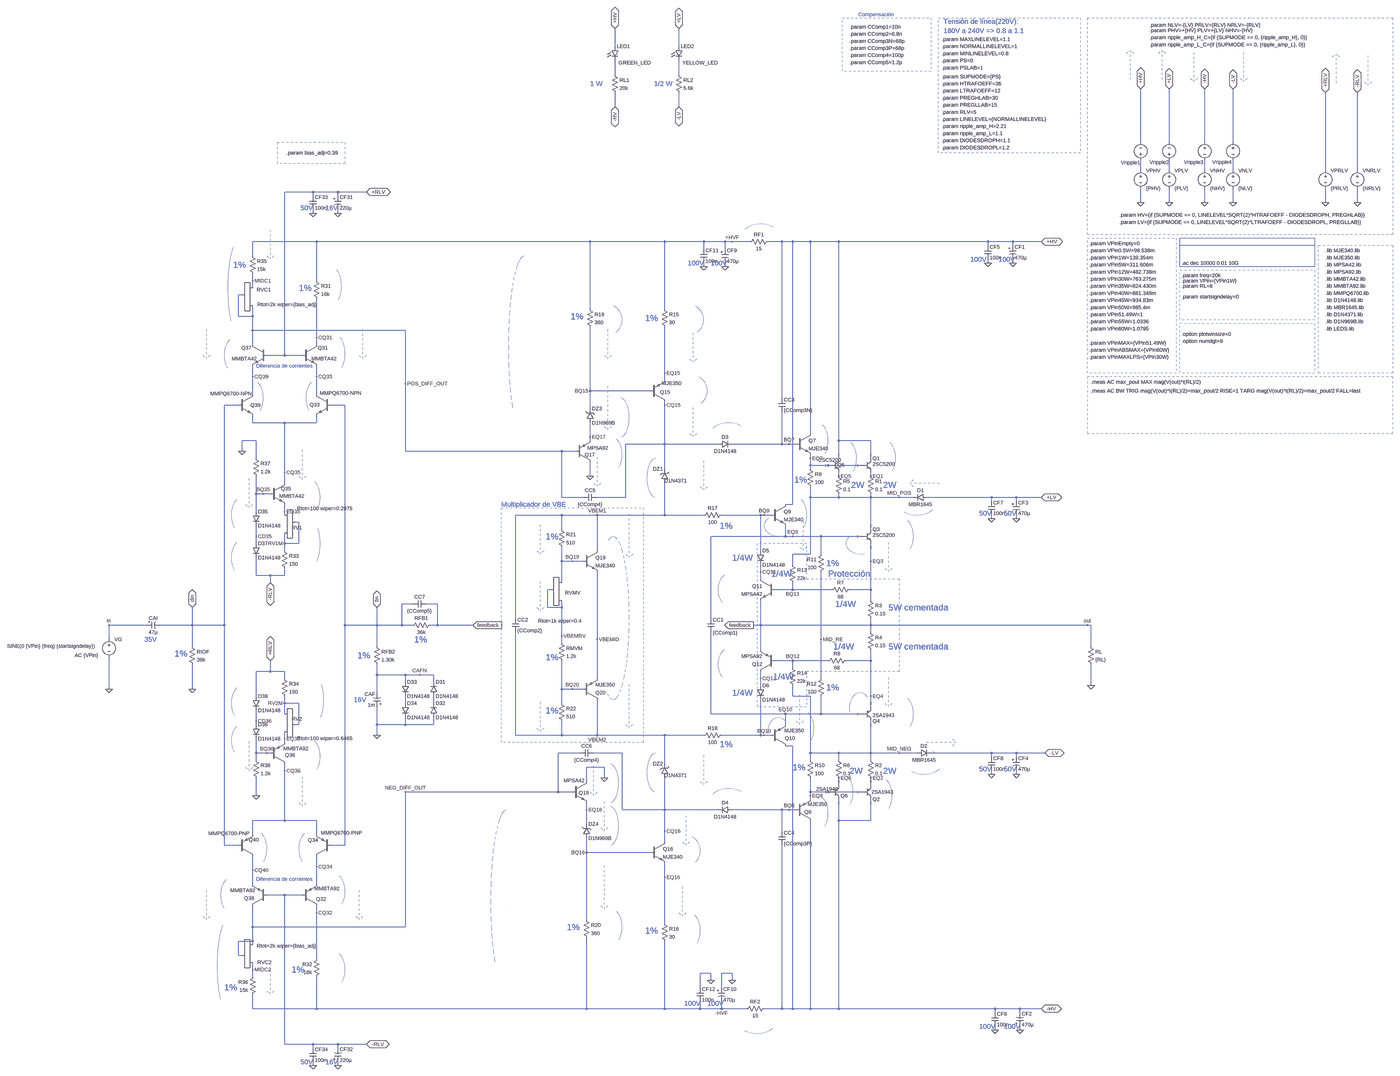
[diagram p0: schematic amplifier_V2.1_1W_BW.asc, whole sheet]
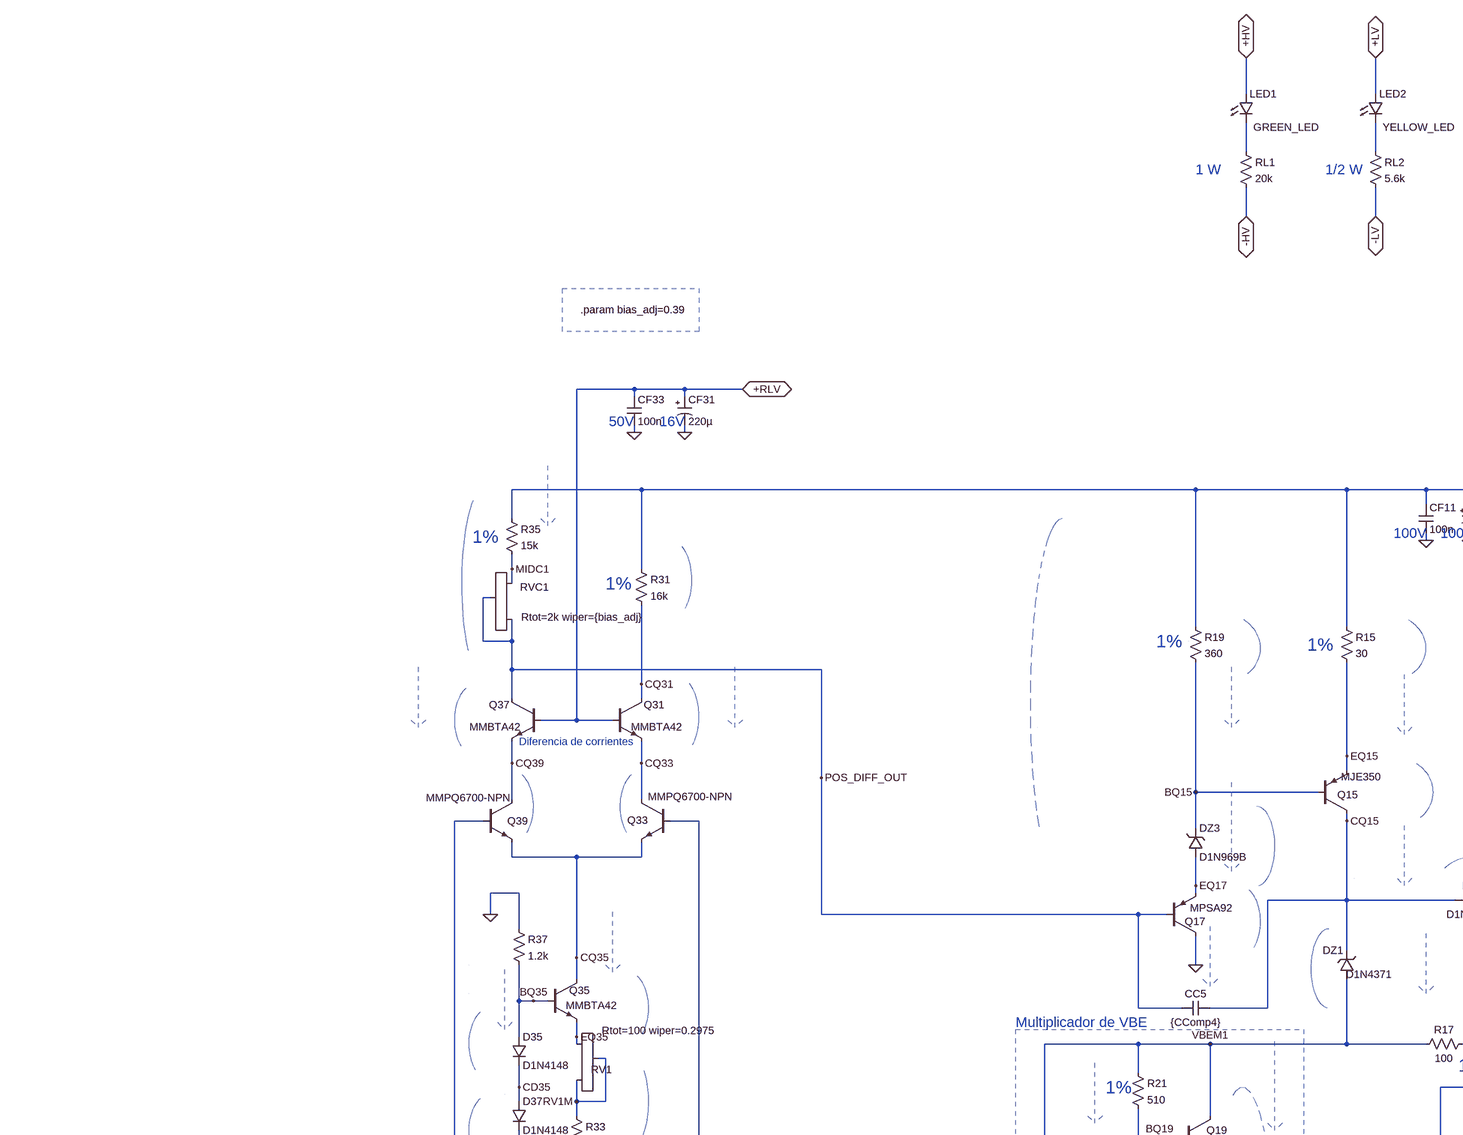
[diagram p1: schematic amplifier_V2.1_1W_BW.asc, part, row 1 of 2, column 1 of 2]
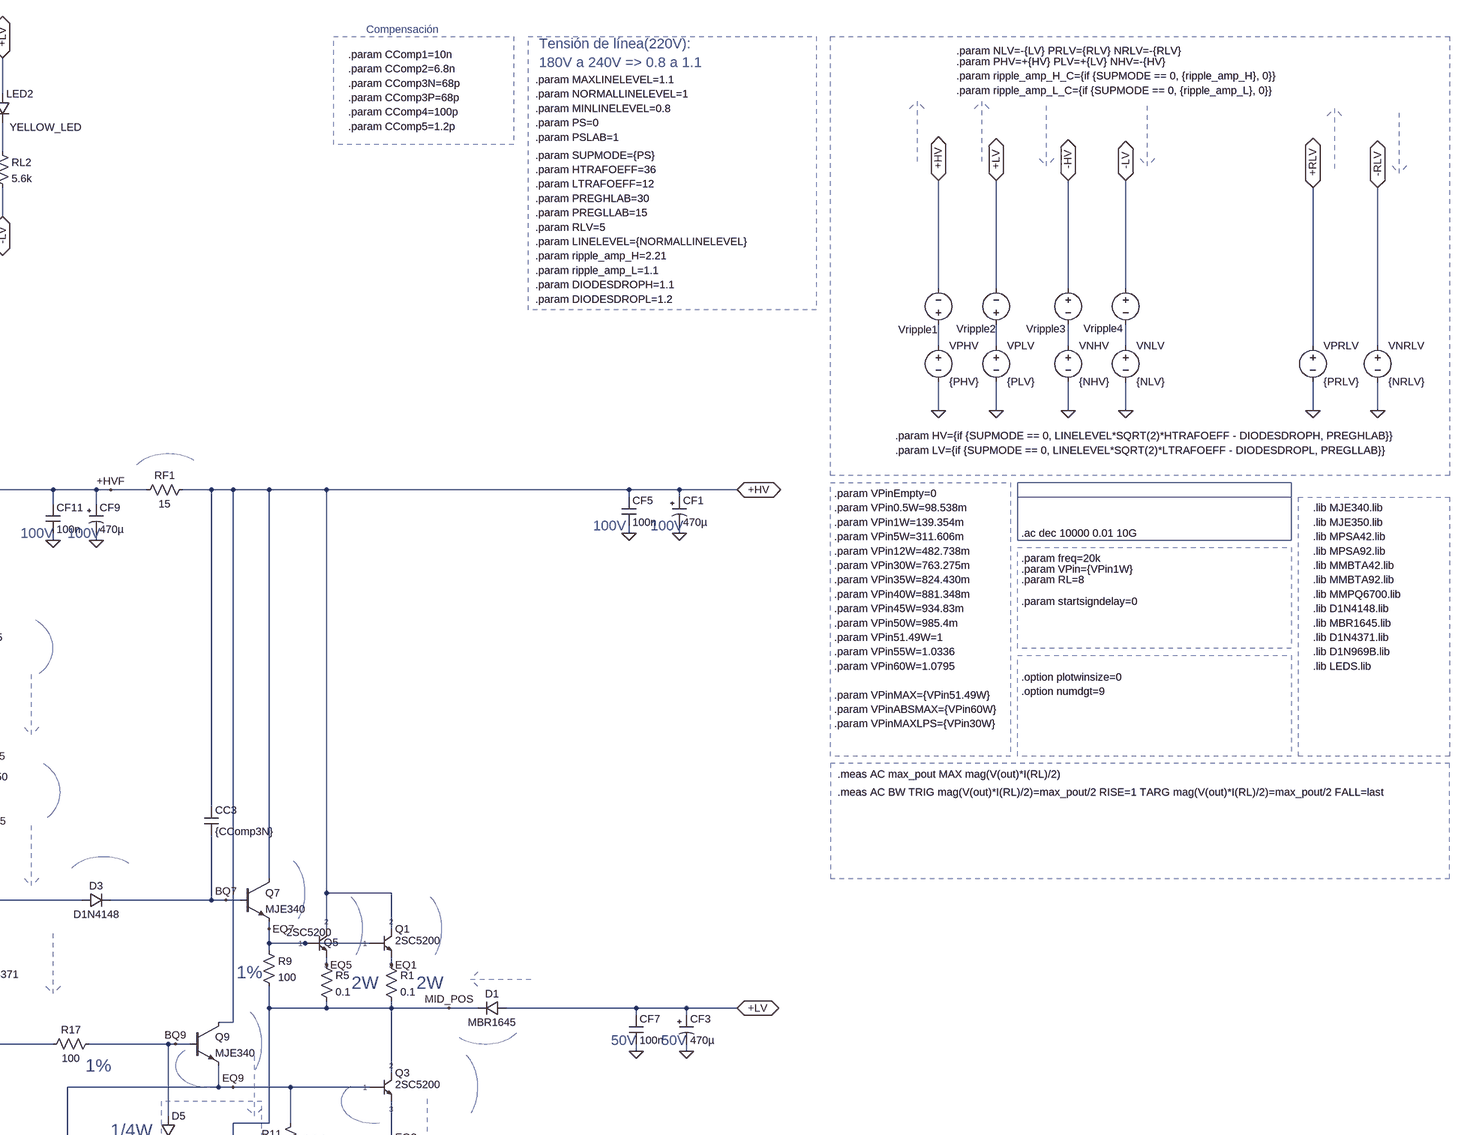
[diagram p2: schematic amplifier_V2.1_1W_BW.asc, part, row 1 of 2, column 2 of 2]
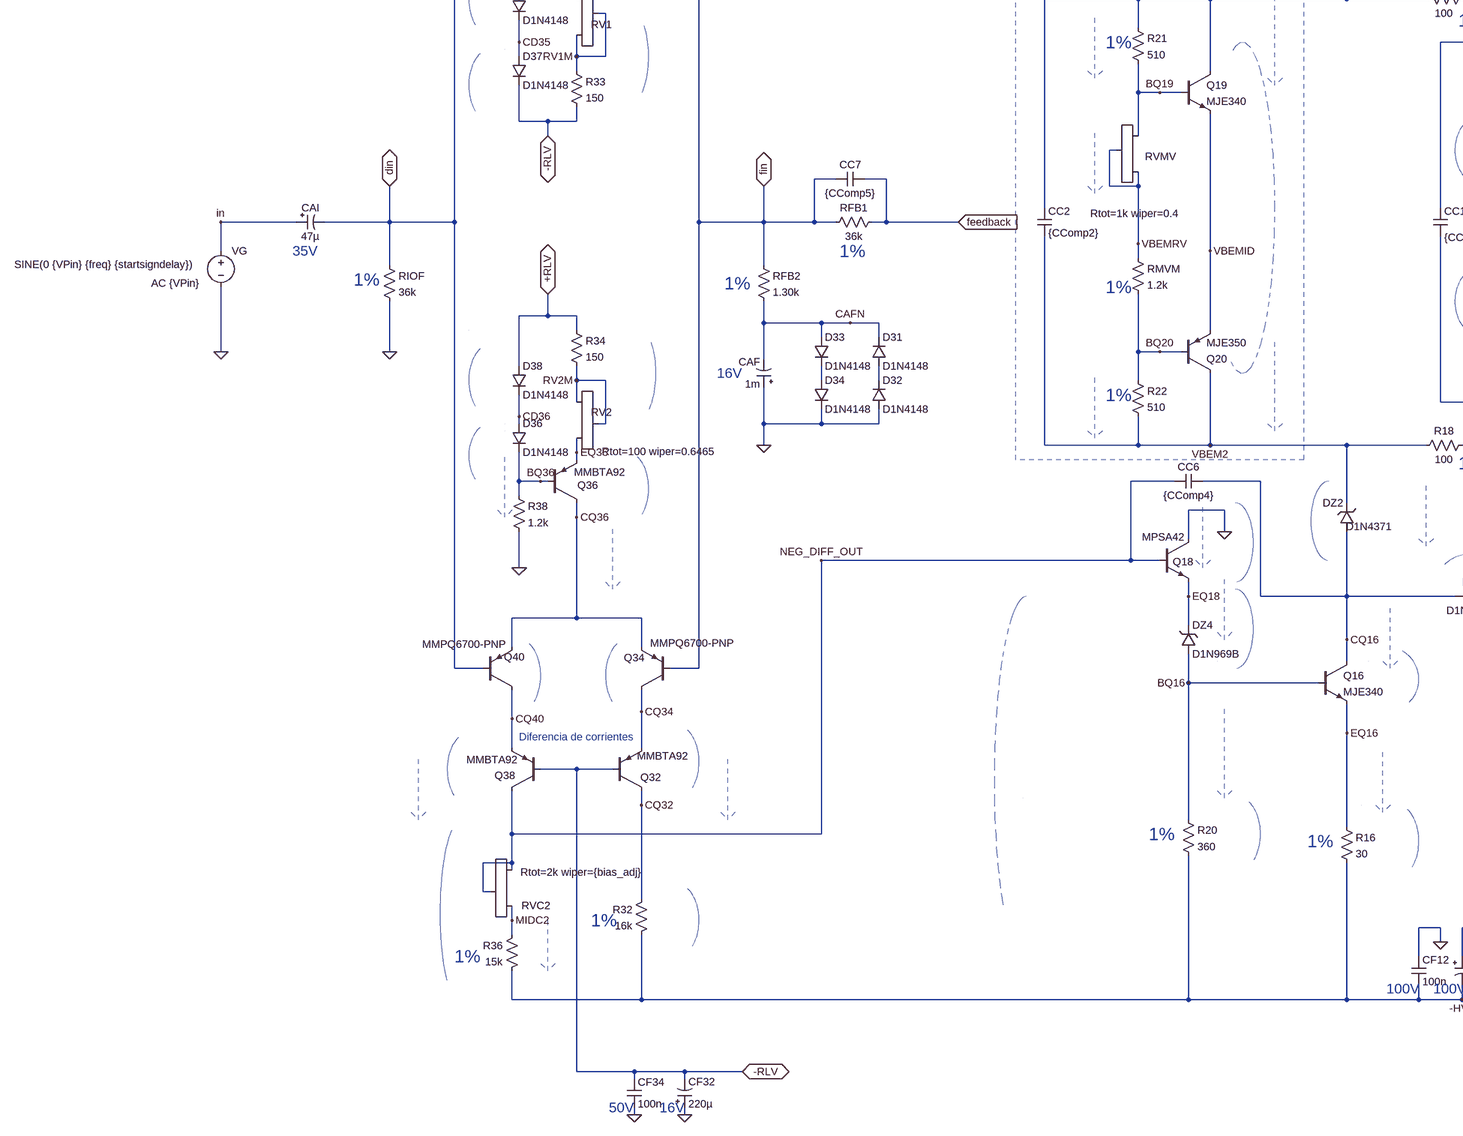
[diagram p3: schematic amplifier_V2.1_1W_BW.asc, part, row 2 of 2, column 1 of 2]
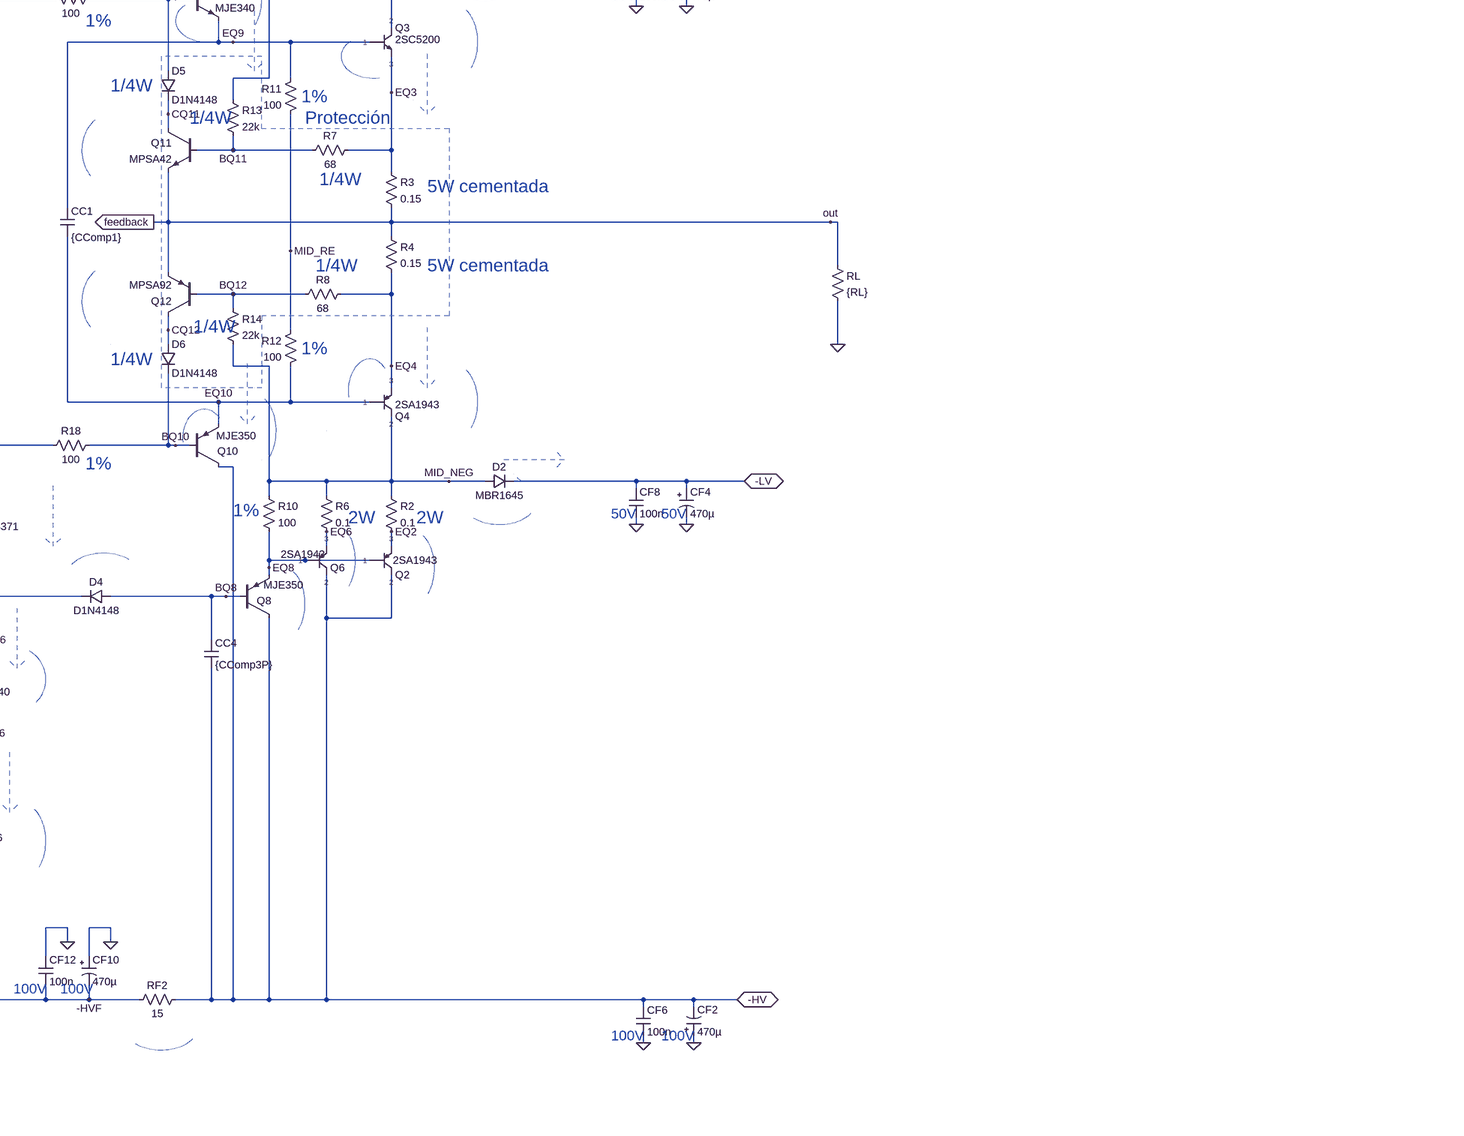
[diagram p4: schematic amplifier_V2.1_1W_BW.asc, part, row 2 of 2, column 2 of 2]
* amplifier_V2.1_1W_BW.asc
Q7 +HV BQ7 EQ7 0 MJE340
R9 EQ7 MID_POS 100
D3 CQ15 BQ7 D1N4148
Q9 +HV BQ9 EQ9 0 MJE340
R3 EQ3 feedback 0.15
R11 EQ9 MID_RE 100
R4 feedback EQ4 0.15
Q10 -HV BQ10 EQ10 0 MJE350
Q8 -HV BQ8 EQ8 0 MJE350
D4 BQ8 CQ16 D1N4148
D2 MID_NEG -LV MBR1645
R12 MID_RE EQ10 100
R2 MID_NEG EQ2 0.1
R6 MID_NEG EQ6 0.1
R5 EQ5 MID_POS 0.1
R1 EQ1 MID_POS 0.1
D1 +LV MID_POS MBR1645
Q20 VBEM2 BQ20 VBEMID 0 MJE350
Q19 VBEM1 BQ19 VBEMID 0 MJE340
R21 VBEM1 BQ19 510
R22 BQ20 VBEM2 510
R17 VBEM1 BQ9 100
R18 BQ10 VBEM2 100
Q15 CQ15 BQ15 EQ15 0 MJE350
Q16 CQ16 BQ16 EQ16 0 MJE340
Q18 0 NEG_DIFF_OUT EQ18 0 MPSA42
RFB2 fin CAFN 1.30k
RFB1 feedback fin 36k
RIOF din 0 36k
Q17 0 POS_DIFF_OUT EQ17 0 MPSA92
Q39 CQ39 din CQ35 0 MMPQ6700-NPN
Q33 CQ33 fin CQ35 0 MMPQ6700-NPN
Q40 CQ40 din CQ36 0 MMPQ6700-PNP
Q34 CQ34 fin CQ36 0 MMPQ6700-PNP
CC5 CQ15 POS_DIFF_OUT {CComp4}
CC6 CQ16 NEG_DIFF_OUT {CComp4}
R15 +HVF EQ15 30
R16 EQ16 -HVF 30
XQ5 +HV EQ7 EQ5 2SC5200  ; pins 2 1 3
XQ1 +HV EQ7 EQ1 2SC5200  ; pins 2 1 3
XQ3 MID_POS EQ9 EQ3 2SC5200  ; pins 2 1 3
XQ4 MID_NEG EQ10 EQ4 2SA1943  ; pins 2 1 3
XQ6 -HV EQ8 EQ6 2SA1943  ; pins 2 1 3
XQ2 -HV EQ8 EQ2 2SA1943  ; pins 2 1 3
R37 0 BQ35 1.2k
Q35 CQ35 BQ35 EQ35 0 MMBTA42
Q36 CQ36 BQ36 EQ36 0 MMBTA92
R38 BQ36 0 1.2k
RL feedback 0 {RL}
CC4 BQ8 -HV {CComp3P}
CC3 +HV BQ7 {CComp3N}
VG in 0 SINE(0 {VPin} {freq} {startsigndelay}) AC {VPin}
CF5 +HV 0 100n
CC7 feedback fin {CComp5}
XRVMV VBEMRV BQ19 VBEMRV Rtot=1k wiper=0.4
D38 +RLV CD36 D1N4148
D35 BQ35 CD35 D1N4148
Q12 CQ12 BQ12 feedback 0 MPSA92
Q11 CQ11 BQ11 feedback 0 MPSA42
D5 BQ9 CQ11 D1N4148
R7 EQ3 BQ11 68
R8 EQ4 BQ12 68
D6 CQ12 BQ10 D1N4148
R13 MID_POS BQ11 22k
R14 BQ12 MID_NEG 22k
CF1 +HV 0 470µ
CF7 +LV 0 100n
CF3 +LV 0 470µ
CF8 -LV 0 100n
CF4 -LV 0 470µ
CF6 -HV 0 100n
CF2 0 -HV 470µ
CF33 +RLV 0 100n
CF31 +RLV 0 220µ
CF34 -RLV 0 100n
CF32 0 -RLV 220µ
CAF 0 CAFN 1m
D33 CAFN N007 D1N4148
D34 N007 0 D1N4148
D32 0 N008 D1N4148
D31 N008 CAFN D1N4148
CAI in din 47µ
R10 MID_NEG EQ8 100
CC2 VBEM1 VBEM2 {CComp2}
VPHV N003 0 {PHV}
VPLV N004 0 {PLV}
VNHV N005 0 {NHV}
VNLV N006 0 {NLV}
VPRLV +RLV 0 {PRLV}
VNRLV -RLV 0 {NRLV}
DZ1 VBEM1 CQ15 D1N4371
DZ2 CQ16 VBEM2 D1N4371
CC1 EQ9 EQ10 {CComp1}
Q37 POS_DIFF_OUT +RLV CQ39 0 MMBTA42
R35 +HVF MIDC1 15k
Q38 NEG_DIFF_OUT -RLV CQ40 0 MMBTA92
R36 MIDC2 -HVF 15k
R19 +HVF BQ15 360
R20 BQ16 -HVF 360
Vripple4 -LV N006 PULSE({ripple_amp_L_C} 0 0 1m 9m 0 10m)
Vripple3 -HV N005 PULSE({ripple_amp_H_C} 0 0 1m 9m 0 10m)
Vripple1 N003 +HV PULSE({ripple_amp_H_C} 0 0 1m 9m 0 10m)
Vripple2 N004 +LV PULSE({ripple_amp_L_C} 0 0 1m 9m 0 10m)
D37 CD35 -RLV D1N4148
D36 CD36 BQ36 D1N4148
Q31 CQ31 +RLV CQ33 0 MMBTA42
R31 +HVF CQ31 16k
Q32 CQ32 -RLV CQ34 0 MMBTA92
R32 CQ32 -HVF 16k
D§LED2 +LV N002 YELLOW_LED
RL2 N002 -LV 5.6k
D§LED1 +HV N001 GREEN_LED
RL1 N001 -HV 20k
RF2 -HV -HVF 15
CF10 0 -HVF 470µ
RF1 +HV +HVF 15
CF9 +HVF 0 470µ
XRV1 RV1M EQ35 RV1M Rtot=100 wiper=0.2975 Rtap=0 tap=0.5
R33 RV1M -RLV 150
XRV2 RV2M EQ36 RV2M Rtot=100 wiper=0.6465 Rtap=0 tap=0.5
R34 +RLV RV2M 150
RMVM VBEMRV BQ20 1.2k
CF11 +HVF 0 100n
CF12 -HVF 0 100n
XRVC1 POS_DIFF_OUT MIDC1 POS_DIFF_OUT Rtot=2k wiper={bias_adj} Rtap=0 tap=0.5
XRVC2 NEG_DIFF_OUT MIDC2 NEG_DIFF_OUT Rtot=2k wiper={bias_adj} Rtap=0 tap=0.5
DZ3 EQ17 BQ15 D1N969B
DZ4 BQ16 EQ18 D1N969B
.model D D
.lib standard.dio
.model NPN NPN
.model PNP PNP
.lib standard.bjt
* Multiplicador de VBE
* Protección
* Diferencia de corrientes
* Diferencia de corrientes
.lib MBR1645.lib
.lib MJE340.lib
.lib MJE350.lib
.lib D1N4148.lib
.ac dec 10000 0.01 10G
.lib MMBTA42.lib
.lib MMBTA92.lib
.lib MMPQ6700.lib
.param PHV=+{HV} PLV=+{LV} NHV=-{HV}
.param HV={if {SUPMODE == 0, LINELEVEL*SQRT(2)*HTRAFOEFF - DIODESDROPH, PREGHLAB}}
.param LV={if {SUPMODE == 0, LINELEVEL*SQRT(2)*LTRAFOEFF - DIODESDROPL, PREGLLAB}}
.param RLV=5
.param NLV=-{LV} PRLV={RLV} NRLV=-{RLV}
.param HTRAFOEFF=36
.param LTRAFOEFF=12
.param LINELEVEL={NORMALLINELEVEL}
* Tensión de línea(220V):
* 180V a 240V => 0.8 a 1.1
.param MAXLINELEVEL=1.1
.param MINLINELEVEL=0.8
.lib D1N4371.lib
.param NORMALLINELEVEL=1
.param SUPMODE={PS}
.param PREGHLAB=30
.param PREGLLAB=15
.param CComp1=10n
.param CComp3N=68p
.param CComp4=100p
* Compensación
.param CComp3P=68p
.param CComp5=1.2p
.param CComp2=6.8n
.lib D1N969B.lib
.param DIODESDROPH=1.1
.param DIODESDROPL=1.2
.param ripple_amp_H_C={if {SUPMODE == 0, {ripple_amp_H}, 0}}
.param ripple_amp_L_C={if {SUPMODE == 0, {ripple_amp_L}, 0}}
.param ripple_amp_H=2.21
.param ripple_amp_L=1.1
.param PS=0
.param PSLAB=1
* 1/2 W
* 1 W
.lib LEDS.lib
.option plotwinsize=0
.option numdgt=9
.param VPin1W=139.354m
.param VPin5W=311.606m
.param VPin12W=482.738m
.param VPin45W=934.83m
.param VPin50W=985.4m
.param VPin30W=763.275m
.param VPin0.5W=98.538m
.param VPinABSMAX={VPin60W}
.param VPinEmpty=0
.param VPinMAXLPS={VPin30W}
.param VPin40W=881.348m
.param VPin35W=824.430m
.param VPin55W=1.0336
.param VPin60W=1.0795
.param VPinMAX={VPin51.49W}
.param VPin51.49W=1
* 1%
* 1%
* 1%
* 1%
* 5W cementada
* 5W cementada
* 2W
* 2W
* 2W
* 2W
* 1/4W
* 1/4W
* 1/4W
* 1/4W
* 1/4W
* 1/4W
* 100V
* 100V
* 100V
* 100V
* 50V
* 50V
* 50V
* 50V
* 100V
* 100V
* 100V
* 100V
* 16V
* 50V
* 16V
* 50V
* 1%
* 1%
* 1%
* 1%
* 1%
* 1%
.lib MPSA42.lib
.lib MPSA92.lib
* 1%
* 1%
* 1%
* 1%
* 1%
* 1%
* 1%
* 1%
* 1%
* 1%
.param bias_adj=0.39
* 16V
.meas AC BW TRIG mag(V(out)*I(RL)/2)=max_pout/2 RISE=1 TARG mag(V(out)*I(RL)/2)=max_pout/2 FALL=last
.meas AC max_pout MAX mag(V(out)*I(RL)/2)
.param freq=20k
.param VPin={VPin1W}
.param RL=8
.param startsigndelay=0
* 35V
.lib 2SC5200.mod
.lib 2SA1943.mod
.backanno
.end